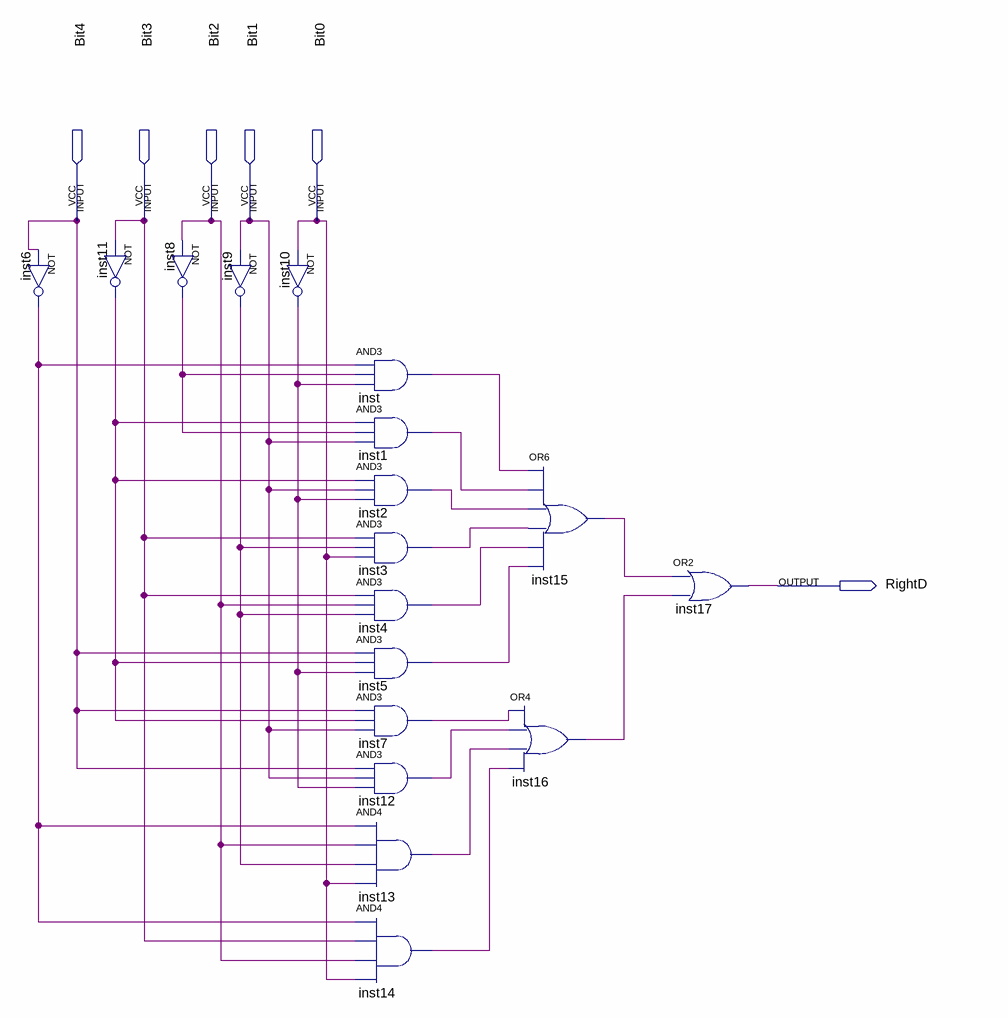
[diagram p0: schematic sheet]
// Quartus schematic RightD.bdf as structural Verilog: 18 symbols, 6 pins
module RightD (
  input  Bit4,
  input  Bit3,
  input  Bit2,
  input  Bit1,
  input  Bit0,
  output RightD
);

  wire inst1_out, inst2_out, inst3_out, inst4_out, inst5_out, inst6_out, inst7_out, inst8_out, inst9_out,
       inst10_out, inst11_out, inst12_out, inst13_out, inst14_out, inst15_out, inst16_out, inst_out;

  not inst6 (inst6_out, Bit4);
  not inst11 (inst11_out, Bit3);
  not inst8 (inst8_out, Bit2);
  not inst9 (inst9_out, Bit1);
  not inst10 (inst10_out, Bit0);
  and inst (inst_out, inst6_out, inst8_out, inst10_out);
  and inst1 (inst1_out, inst11_out, inst8_out, Bit1);
  and inst2 (inst2_out, inst11_out, Bit1, inst10_out);
  and inst3 (inst3_out, Bit3, inst9_out, Bit0);
  and inst4 (inst4_out, Bit3, Bit2, inst9_out);
  and inst5 (inst5_out, Bit4, inst11_out, inst10_out);
  and inst7 (inst7_out, Bit4, inst11_out, Bit1);
  and inst12 (inst12_out, Bit4, Bit1, inst10_out);
  and inst13 (inst13_out, inst6_out, Bit2, inst9_out, Bit0);
  and inst14 (inst14_out, inst6_out, Bit3, Bit2, Bit0);
  or inst15 (inst15_out, inst_out, inst1_out, inst2_out, inst3_out, inst4_out, inst5_out);
  or inst16 (inst16_out, inst7_out, inst12_out, inst13_out, inst14_out);
  or inst17 (RightD, inst15_out, inst16_out);
endmodule
